# Altium schematic sheet som.SchDoc
size D; CompanyName: Signal Laboratories, Inc.; Address1: 3479 Edison Way; Address2: Menlo Park CA 94025; Address3: +1 (877) 778-8435; Address4: siglabs.com; Revision: 1; SheetNumber: 1; SheetTotal: 1
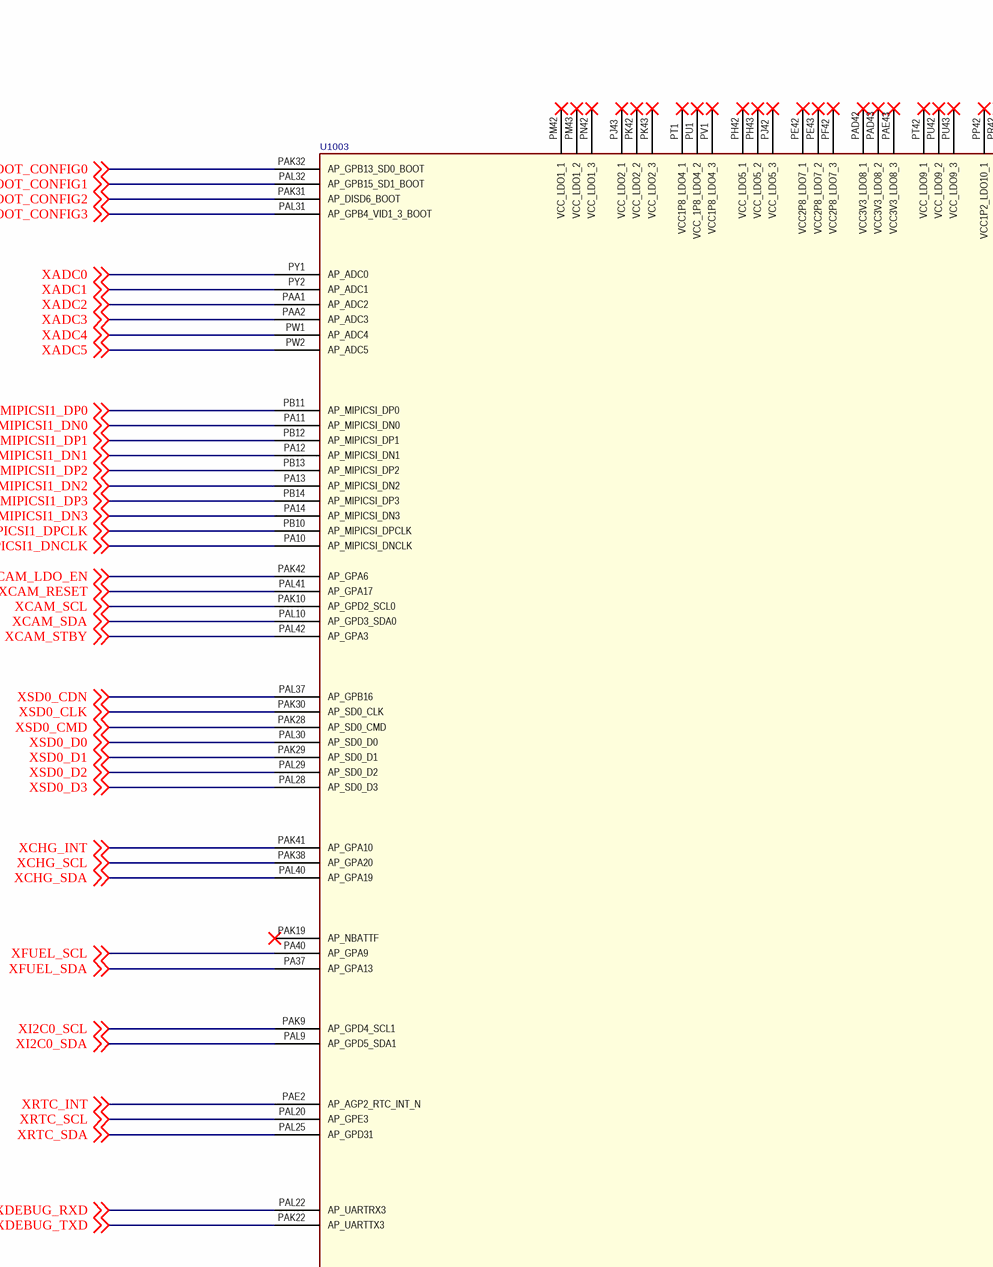
[diagram p0: som.SchDoc, top left]
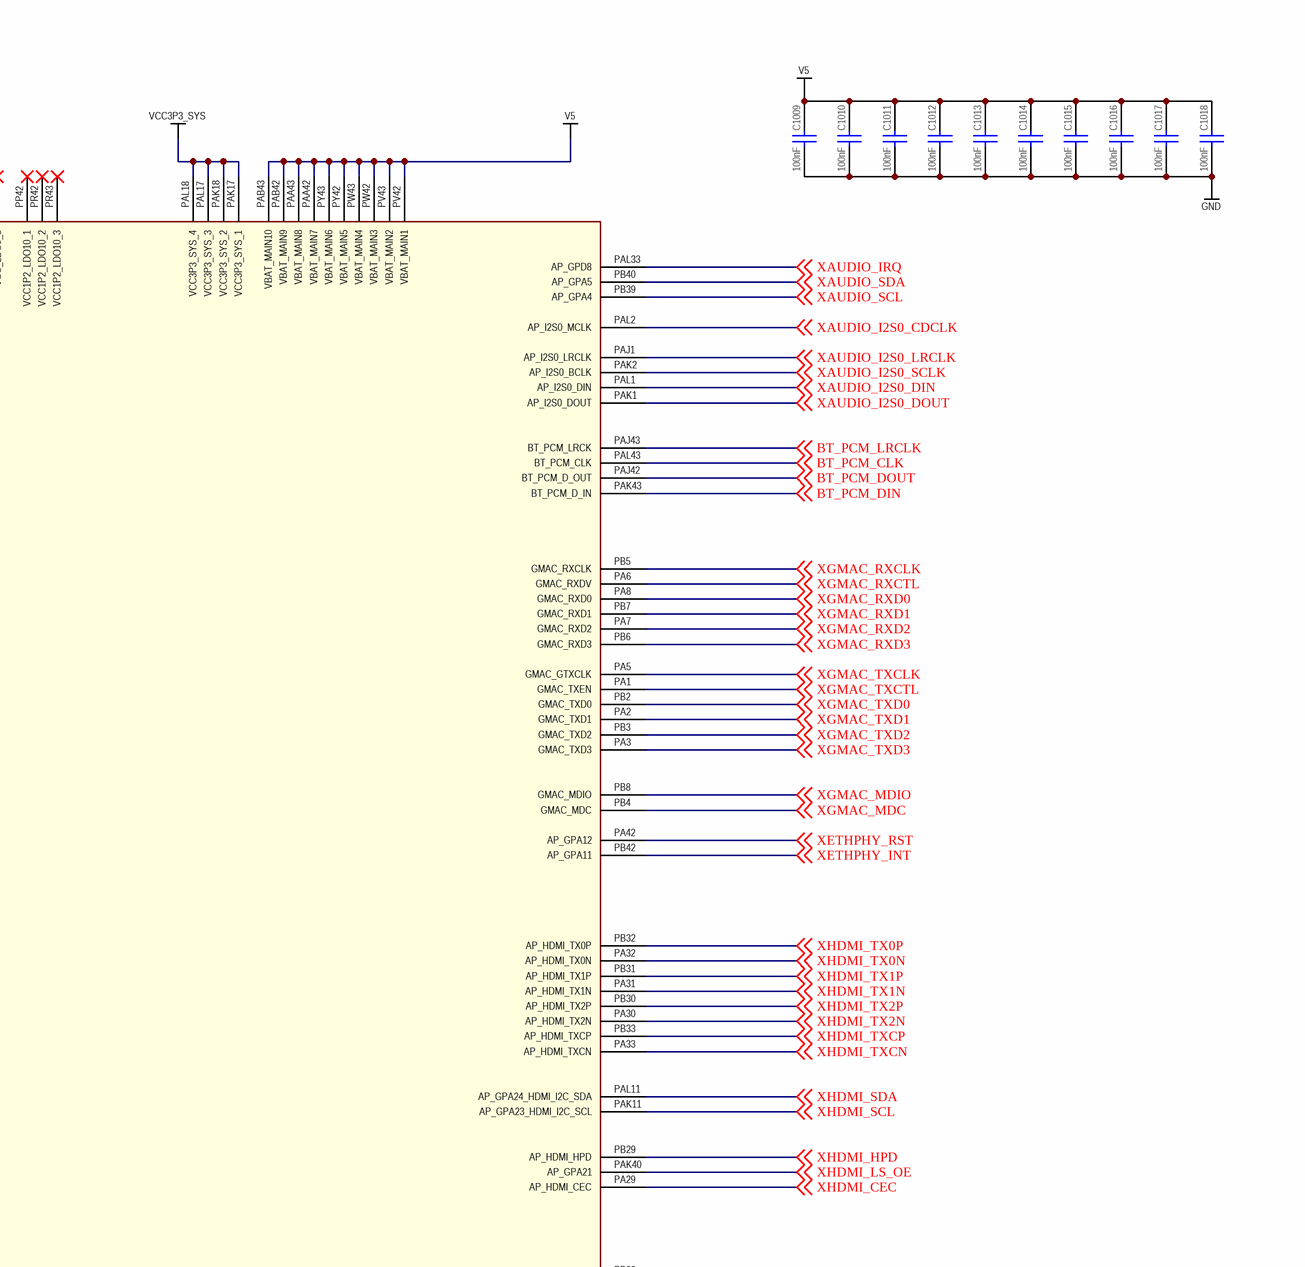
[diagram p1: som.SchDoc, top right]
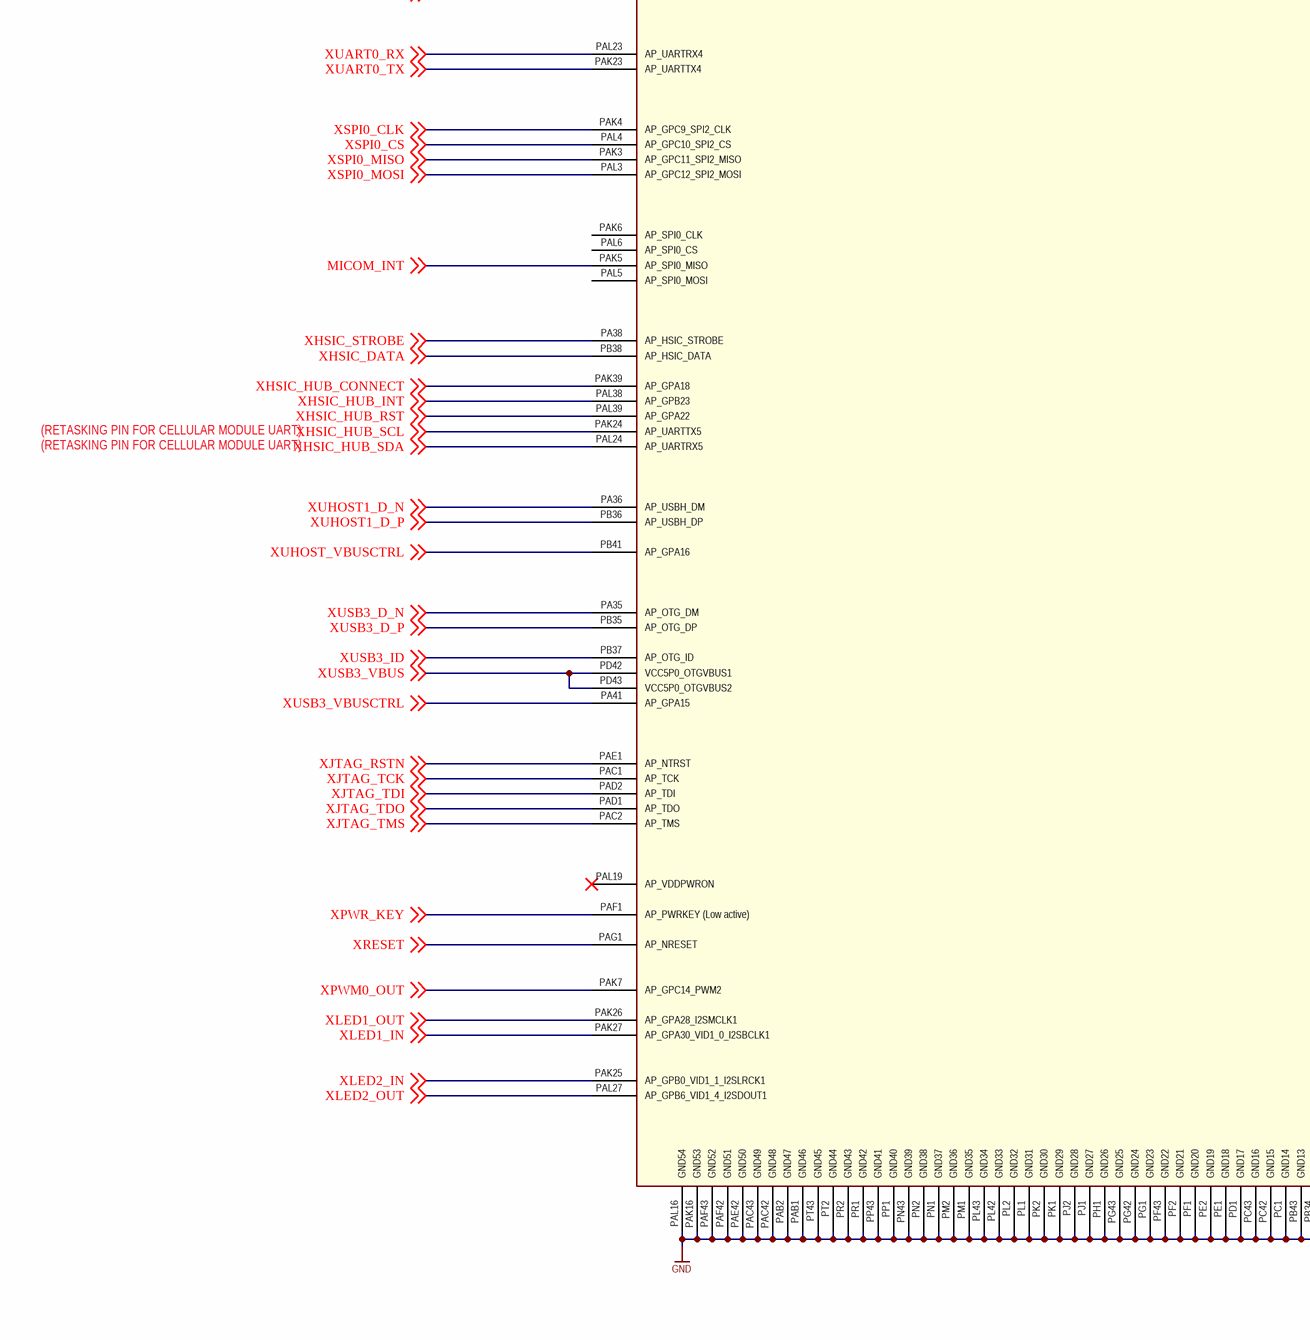
[diagram p2: som.SchDoc, bottom left]
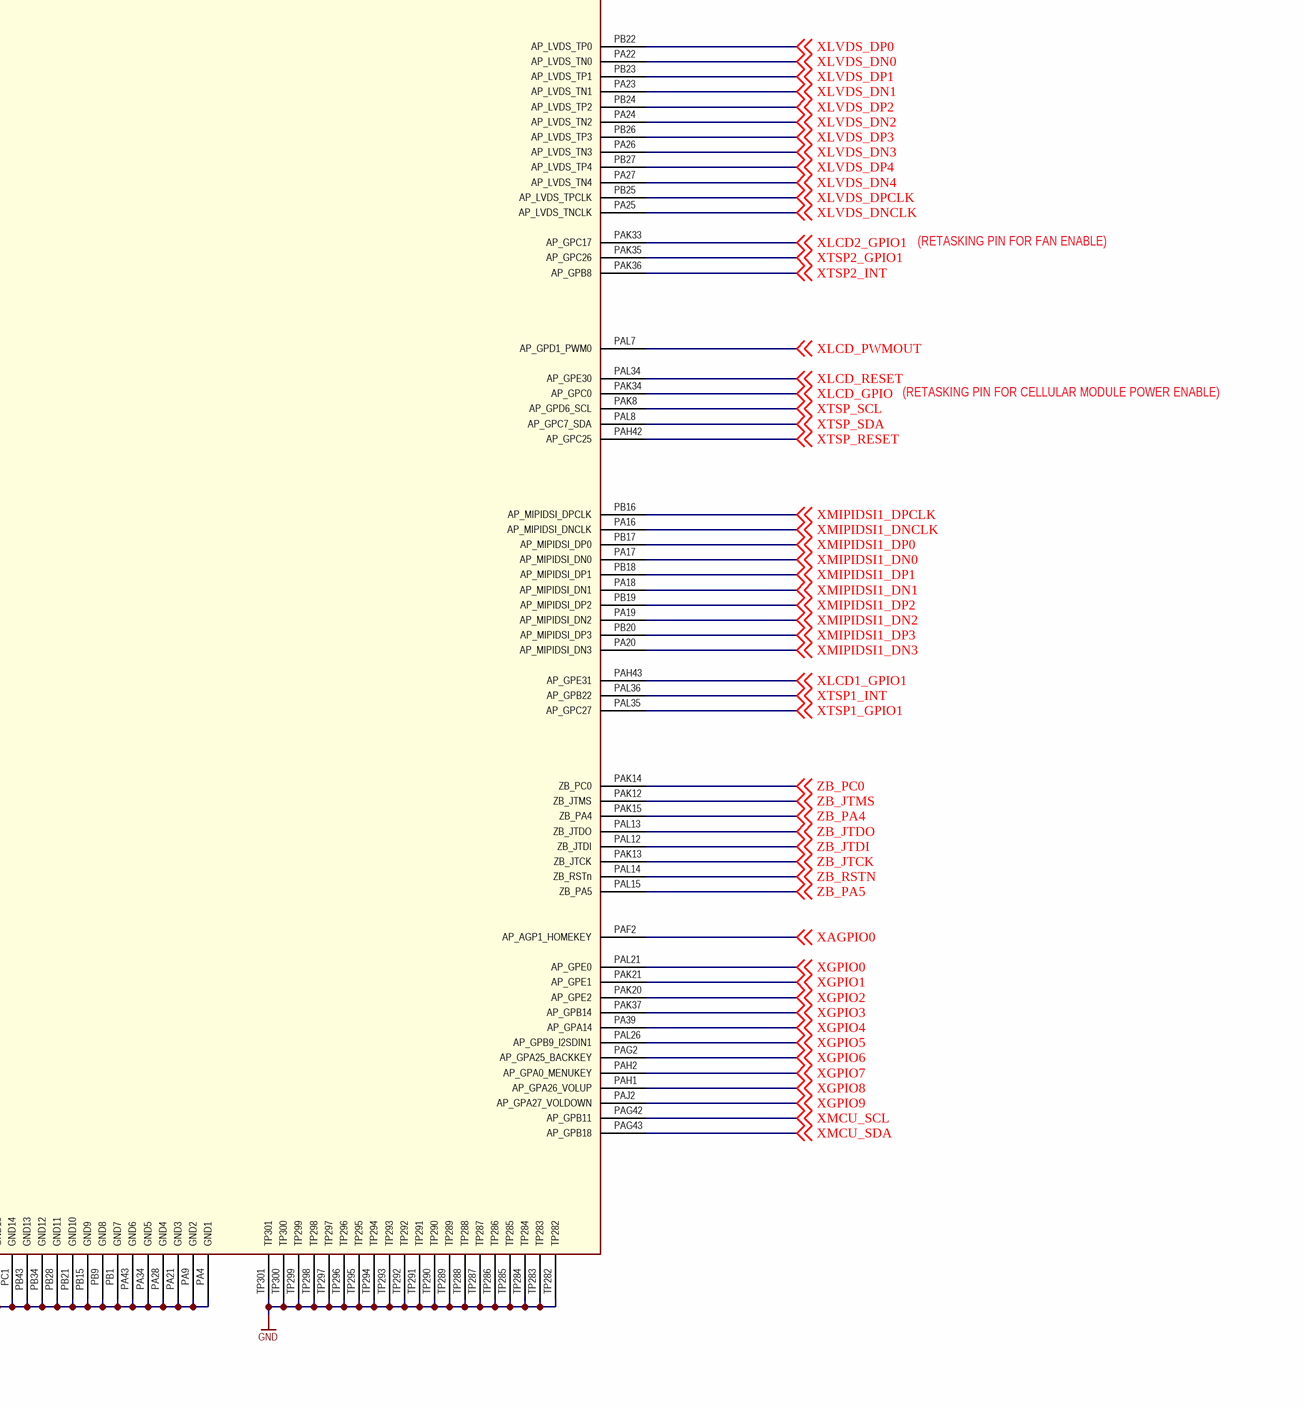
[diagram p3: som.SchDoc, bottom right]

## Parts
C1009  value 100nF  [CAPC100X50X55L25N]  (hidden comment: GCM155R71H104KE02)
C1010  value 100nF  [CAPC100X50X55L25N]  (hidden comment: GCM155R71H104KE02)
C1011  value 100nF  [CAPC100X50X55L25N]  (hidden comment: GCM155R71H104KE02)
C1012  value 100nF  [CAPC100X50X55L25N]  (hidden comment: GCM155R71H104KE02)
C1013  value 100nF  [CAPC100X50X55L25N]  (hidden comment: GCM155R71H104KE02)
C1014  value 100nF  [CAPC100X50X55L25N]  (hidden comment: GCM155R71H104KE02)
C1015  value 100nF  [CAPC100X50X55L25N]  (hidden comment: GCM155R71H104KE02)
C1016  value 100nF  [CAPC100X50X55L25N]  (hidden comment: GCM155R71H104KE02)
C1017  value 100nF  [CAPC100X50X55L25N]  (hidden comment: GCM155R71H104KE02)
C1018  value 100nF  [CAPC100X50X55L25N]  (hidden comment: GCM155R71H104KE02)
U1003  ARTIK_710_LGA_PAD  [ARTIK_LGA_PAD_10]  (value not drawn)

## Nets
GND: C1009.1 C1010.1 C1011.1 C1012.1 C1013.1 C1014.1 C1015.1 C1016.1 C1017.1 C1018.1 U1003.PA4(GND1) U1003.PA9(GND2) U1003.PA21(GND3) U1003.PA28(GND4) U1003.PA34(GND5) U1003.PA43(GND6) U1003.PAB1(GND46) U1003.PAB2(GND47) U1003.PAC42(GND48) U1003.PAC43(GND49) U1003.PAE42(GND50) U1003.PAF42(GND51) U1003.PAF43(GND52) U1003.PAK16(GND53) U1003.PAL16(GND54) U1003.PB1(GND7) U1003.PB9(GND8) U1003.PB15(GND9) U1003.PB21(GND10) U1003.PB28(GND11) U1003.PB34(GND12) U1003.PB43(GND13) U1003.PC1(GND14) U1003.PC42(GND15) U1003.PC43(GND16) U1003.PD1(GND17) U1003.PE1(GND18) U1003.PE2(GND19) U1003.PF1(GND20) U1003.PF2(GND21) U1003.PF43(GND22) U1003.PG1(GND23) U1003.PG42(GND24) U1003.PG43(GND25) U1003.PH1(GND26) U1003.PJ1(GND27) U1003.PJ2(GND28) U1003.PK1(GND29) U1003.PK2(GND30) U1003.PL1(GND31) U1003.PL2(GND32) U1003.PL42(GND33) U1003.PL43(GND34) U1003.PM1(GND35) U1003.PM2(GND36) U1003.PN1(GND37) U1003.PN2(GND38) U1003.PN43(GND39) U1003.PP1(GND40) U1003.PP43(GND41) U1003.PR1(GND42) U1003.PR2(GND43) U1003.PT2(GND44) U1003.PT43(GND45) U1003.TP282 U1003.TP283 U1003.TP284 U1003.TP285 U1003.TP286 U1003.TP287 U1003.TP288 U1003.TP289 U1003.TP290 U1003.TP291 U1003.TP292 U1003.TP293 U1003.TP294 U1003.TP295 U1003.TP296 U1003.TP297 U1003.TP298 U1003.TP299 U1003.TP300 U1003.TP301
V5: C1009.2 C1010.2 C1011.2 C1012.2 C1013.2 C1014.2 C1015.2 C1016.2 C1017.2 C1018.2 U1003.PAA42(VBAT_MAIN7) U1003.PAA43(VBAT_MAIN8) U1003.PAB42(VBAT_MAIN9) U1003.PAB43(VBAT_MAIN10) U1003.PV42(VBAT_MAIN1) U1003.PV43(VBAT_MAIN2) U1003.PW42(VBAT_MAIN3) U1003.PW43(VBAT_MAIN4) U1003.PY42(VBAT_MAIN5) U1003.PY43(VBAT_MAIN6)
VCC3P3_SYS: U1003.PAK17(VCC3P3_SYS_1) U1003.PAK18(VCC3P3_SYS_2) U1003.PAL17(VCC3P3_SYS_3) U1003.PAL18(VCC3P3_SYS_4)
BT_PCM_CLK: U1003.PAL43(BT_PCM_CLK) ; off-sheet BT_PCM_CLK
BT_PCM_DIN: U1003.PAK43(BT_PCM_D_IN) ; off-sheet BT_PCM_DIN
BT_PCM_DOUT: U1003.PAJ42(BT_PCM_D_OUT) ; off-sheet BT_PCM_DOUT
BT_PCM_LRCLK: U1003.PAJ43(BT_PCM_LRCK) ; off-sheet BT_PCM_LRCLK
MICOM_INT: U1003.PAK5(AP_SPI0_MISO) ; off-sheet MICOM_INT
XADC0: U1003.PY1(AP_ADC0) ; off-sheet XADC0
XADC1: U1003.PY2(AP_ADC1) ; off-sheet XADC1
XADC2: U1003.PAA1(AP_ADC2) ; off-sheet XADC2
XADC3: U1003.PAA2(AP_ADC3) ; off-sheet XADC3
XADC4: U1003.PW1(AP_ADC4) ; off-sheet XADC4
XADC5: U1003.PW2(AP_ADC5) ; off-sheet XADC5
XAGPIO0: U1003.PAF2(AP_AGP1_HOMEKEY) ; off-sheet XAGPIO0
XAUDIO_I2S0_CDCLK: U1003.PAL2(AP_I2S0_MCLK) ; off-sheet XAUDIO_I2S0_CDCLK
XAUDIO_I2S0_DIN: U1003.PAL1(AP_I2S0_DIN) ; off-sheet XAUDIO_I2S0_DIN
XAUDIO_I2S0_DOUT: U1003.PAK1(AP_I2S0_DOUT) ; off-sheet XAUDIO_I2S0_DOUT
XAUDIO_I2S0_LRCLK: U1003.PAJ1(AP_I2S0_LRCLK) ; off-sheet XAUDIO_I2S0_LRCLK
XAUDIO_I2S0_SCLK: U1003.PAK2(AP_I2S0_BCLK) ; off-sheet XAUDIO_I2S0_SCLK
XAUDIO_IRQ: U1003.PAL33(AP_GPD8) ; off-sheet XAUDIO_IRQ
XAUDIO_SCL: U1003.PB39(AP_GPA4) ; off-sheet XAUDIO_SCL
XAUDIO_SDA: U1003.PB40(AP_GPA5) ; off-sheet XAUDIO_SDA
XBOOT_CONFIG0: U1003.PAK32(AP_GPB13_SD0_BOOT) ; off-sheet XBOOT_CONFIG0
XBOOT_CONFIG1: U1003.PAL32(AP_GPB15_SD1_BOOT) ; off-sheet XBOOT_CONFIG1
XBOOT_CONFIG2: U1003.PAK31(AP_DISD6_BOOT) ; off-sheet XBOOT_CONFIG2
XBOOT_CONFIG3: U1003.PAL31(AP_GPB4_VID1_3_BOOT) ; off-sheet XBOOT_CONFIG3
XCAM_LDO_EN: U1003.PAK42(AP_GPA6) ; off-sheet XCAM_LDO_EN
XCAM_RESET: U1003.PAL41(AP_GPA17) ; off-sheet XCAM_RESET
XCAM_SCL: U1003.PAK10(AP_GPD2_SCL0) ; off-sheet XCAM_SCL
XCAM_SDA: U1003.PAL10(AP_GPD3_SDA0) ; off-sheet XCAM_SDA
XCAM_STBY: U1003.PAL42(AP_GPA3) ; off-sheet XCAM_STBY
XCHG_INT: U1003.PAK41(AP_GPA10) ; off-sheet XCHG_INT
XCHG_SCL: U1003.PAK38(AP_GPA20) ; off-sheet XCHG_SCL
XCHG_SDA: U1003.PAL40(AP_GPA19) ; off-sheet XCHG_SDA
XDEBUG_RXD: U1003.PAL22(AP_UARTRX3) ; off-sheet XDEBUG_RXD
XDEBUG_TXD: U1003.PAK22(AP_UARTTX3) ; off-sheet XDEBUG_TXD
XETHPHY_INT: U1003.PB42(AP_GPA11) ; off-sheet XETHPHY_INT
XETHPHY_RST: U1003.PA42(AP_GPA12) ; off-sheet XETHPHY_RST
XFUEL_SCL: U1003.PA40(AP_GPA9) ; off-sheet XFUEL_SCL
XFUEL_SDA: U1003.PA37(AP_GPA13) ; off-sheet XFUEL_SDA
XGMAC_MDC: U1003.PB4(GMAC_MDC) ; off-sheet XGMAC_MDC
XGMAC_MDIO: U1003.PB8(GMAC_MDIO) ; off-sheet XGMAC_MDIO
XGMAC_RXCLK: U1003.PB5(GMAC_RXCLK) ; off-sheet XGMAC_RXCLK
XGMAC_RXCTL: U1003.PA6(GMAC_RXDV) ; off-sheet XGMAC_RXCTL
XGMAC_RXD0: U1003.PA8(GMAC_RXD0) ; off-sheet XGMAC_RXD0
XGMAC_RXD1: U1003.PB7(GMAC_RXD1) ; off-sheet XGMAC_RXD1
XGMAC_RXD2: U1003.PA7(GMAC_RXD2) ; off-sheet XGMAC_RXD2
XGMAC_RXD3: U1003.PB6(GMAC_RXD3) ; off-sheet XGMAC_RXD3
XGMAC_TXCLK: U1003.PA5(GMAC_GTXCLK) ; off-sheet XGMAC_TXCLK
XGMAC_TXCTL: U1003.PA1(GMAC_TXEN) ; off-sheet XGMAC_TXCTL
XGMAC_TXD0: U1003.PB2(GMAC_TXD0) ; off-sheet XGMAC_TXD0
XGMAC_TXD1: U1003.PA2(GMAC_TXD1) ; off-sheet XGMAC_TXD1
XGMAC_TXD2: U1003.PB3(GMAC_TXD2) ; off-sheet XGMAC_TXD2
XGMAC_TXD3: U1003.PA3(GMAC_TXD3) ; off-sheet XGMAC_TXD3
XGPIO0: U1003.PAL21(AP_GPE0) ; off-sheet XGPIO0
XGPIO1: U1003.PAK21(AP_GPE1) ; off-sheet XGPIO1
XGPIO2: U1003.PAK20(AP_GPE2) ; off-sheet XGPIO2
XGPIO3: U1003.PAK37(AP_GPB14) ; off-sheet XGPIO3
XGPIO4: U1003.PA39(AP_GPA14) ; off-sheet XGPIO4
XGPIO5: U1003.PAL26(AP_GPB9_I2SDIN1) ; off-sheet XGPIO5
XGPIO6: U1003.PAG2(AP_GPA25_BACKKEY) ; off-sheet XGPIO6
XGPIO7: U1003.PAH2(AP_GPA0_MENUKEY) ; off-sheet XGPIO7
XGPIO8: U1003.PAH1(AP_GPA26_VOLUP) ; off-sheet XGPIO8
XGPIO9: U1003.PAJ2(AP_GPA27_VOLDOWN) ; off-sheet XGPIO9
XHDMI_CEC: U1003.PA29(AP_HDMI_CEC) ; off-sheet XHDMI_CEC
XHDMI_HPD: U1003.PB29(AP_HDMI_HPD) ; off-sheet XHDMI_HPD
XHDMI_LS_OE: U1003.PAK40(AP_GPA21) ; off-sheet XHDMI_LS_OE
XHDMI_SCL: U1003.PAK11(AP_GPA23_HDMI_I2C_SCL) ; off-sheet XHDMI_SCL
XHDMI_SDA: U1003.PAL11(AP_GPA24_HDMI_I2C_SDA) ; off-sheet XHDMI_SDA
XHDMI_TX0N: U1003.PA32(AP_HDMI_TX0N) ; off-sheet XHDMI_TX0N
XHDMI_TX0P: U1003.PB32(AP_HDMI_TX0P) ; off-sheet XHDMI_TX0P
XHDMI_TX1N: U1003.PA31(AP_HDMI_TX1N) ; off-sheet XHDMI_TX1N
XHDMI_TX1P: U1003.PB31(AP_HDMI_TX1P) ; off-sheet XHDMI_TX1P
XHDMI_TX2N: U1003.PA30(AP_HDMI_TX2N) ; off-sheet XHDMI_TX2N
XHDMI_TX2P: U1003.PB30(AP_HDMI_TX2P) ; off-sheet XHDMI_TX2P
XHDMI_TXCN: U1003.PA33(AP_HDMI_TXCN) ; off-sheet XHDMI_TXCN
XHDMI_TXCP: U1003.PB33(AP_HDMI_TXCP) ; off-sheet XHDMI_TXCP
XHSIC_DATA: U1003.PB38(AP_HSIC_DATA) ; off-sheet XHSIC_DATA
XHSIC_HUB_CONNECT: U1003.PAK39(AP_GPA18) ; off-sheet XHSIC_HUB_CONNECT
XHSIC_HUB_INT: U1003.PAL38(AP_GPB23) ; off-sheet XHSIC_HUB_INT
XHSIC_HUB_RST: U1003.PAL39(AP_GPA22) ; off-sheet XHSIC_HUB_RST
XHSIC_HUB_SCL: U1003.PAK24(AP_UARTTX5) ; off-sheet XHSIC_HUB_SCL
XHSIC_HUB_SDA: U1003.PAL24(AP_UARTRX5) ; off-sheet XHSIC_HUB_SDA
XHSIC_STROBE: U1003.PA38(AP_HSIC_STROBE) ; off-sheet XHSIC_STROBE
XI2C0_SCL: U1003.PAK9(AP_GPD4_SCL1) ; off-sheet XI2C0_SCL
XI2C0_SDA: U1003.PAL9(AP_GPD5_SDA1) ; off-sheet XI2C0_SDA
XJTAG_RSTN: U1003.PAE1(AP_NTRST) ; off-sheet XJTAG_RSTN
XJTAG_TCK: U1003.PAC1(AP_TCK) ; off-sheet XJTAG_TCK
XJTAG_TDI: U1003.PAD2(AP_TDI) ; off-sheet XJTAG_TDI
XJTAG_TDO: U1003.PAD1(AP_TDO) ; off-sheet XJTAG_TDO
XJTAG_TMS: U1003.PAC2(AP_TMS) ; off-sheet XJTAG_TMS
XLCD1_GPIO1: U1003.PAH43(AP_GPE31) ; off-sheet XLCD1_GPIO1
XLCD2_GPIO1: U1003.PAK33(AP_GPC17) ; off-sheet XLCD2_GPIO1
XLCD_GPIO: U1003.PAK34(AP_GPC0) ; off-sheet XLCD_GPIO
XLCD_PWMOUT: U1003.PAL7(AP_GPD1_PWM0) ; off-sheet XLCD_PWMOUT
XLCD_RESET: U1003.PAL34(AP_GPE30) ; off-sheet XLCD_RESET
XLED1_IN: U1003.PAK27(AP_GPA30_VID1_0_I2SBCLK1) ; off-sheet XLED1_IN
XLED1_OUT: U1003.PAK26(AP_GPA28_I2SMCLK1) ; off-sheet XLED1_OUT
XLED2_IN: U1003.PAK25(AP_GPB0_VID1_1_I2SLRCK1) ; off-sheet XLED2_IN
XLED2_OUT: U1003.PAL27(AP_GPB6_VID1_4_I2SDOUT1) ; off-sheet XLED2_OUT
XLVDS_DN0: U1003.PA22(AP_LVDS_TN0) ; off-sheet XLVDS_DN0
XLVDS_DN1: U1003.PA23(AP_LVDS_TN1) ; off-sheet XLVDS_DN1
XLVDS_DN2: U1003.PA24(AP_LVDS_TN2) ; off-sheet XLVDS_DN2
XLVDS_DN3: U1003.PA26(AP_LVDS_TN3) ; off-sheet XLVDS_DN3
XLVDS_DN4: U1003.PA27(AP_LVDS_TN4) ; off-sheet XLVDS_DN4
XLVDS_DNCLK: U1003.PA25(AP_LVDS_TNCLK) ; off-sheet XLVDS_DNCLK
XLVDS_DP0: U1003.PB22(AP_LVDS_TP0) ; off-sheet XLVDS_DP0
XLVDS_DP1: U1003.PB23(AP_LVDS_TP1) ; off-sheet XLVDS_DP1
XLVDS_DP2: U1003.PB24(AP_LVDS_TP2) ; off-sheet XLVDS_DP2
XLVDS_DP3: U1003.PB26(AP_LVDS_TP3) ; off-sheet XLVDS_DP3
XLVDS_DP4: U1003.PB27(AP_LVDS_TP4) ; off-sheet XLVDS_DP4
XLVDS_DPCLK: U1003.PB25(AP_LVDS_TPCLK) ; off-sheet XLVDS_DPCLK
XMCU_SCL: U1003.PAG42(AP_GPB11) ; off-sheet XMCU_SCL
XMCU_SDA: U1003.PAG43(AP_GPB18) ; off-sheet XMCU_SDA
XMIPICSI1_DN0: U1003.PA11(AP_MIPICSI_DN0) ; off-sheet XMIPICSI1_DN0
XMIPICSI1_DN1: U1003.PA12(AP_MIPICSI_DN1) ; off-sheet XMIPICSI1_DN1
XMIPICSI1_DN2: U1003.PA13(AP_MIPICSI_DN2) ; off-sheet XMIPICSI1_DN2
XMIPICSI1_DN3: U1003.PA14(AP_MIPICSI_DN3) ; off-sheet XMIPICSI1_DN3
XMIPICSI1_DNCLK: U1003.PA10(AP_MIPICSI_DNCLK) ; off-sheet XMIPICSI1_DNCLK
XMIPICSI1_DP0: U1003.PB11(AP_MIPICSI_DP0) ; off-sheet XMIPICSI1_DP0
XMIPICSI1_DP1: U1003.PB12(AP_MIPICSI_DP1) ; off-sheet XMIPICSI1_DP1
XMIPICSI1_DP2: U1003.PB13(AP_MIPICSI_DP2) ; off-sheet XMIPICSI1_DP2
XMIPICSI1_DP3: U1003.PB14(AP_MIPICSI_DP3) ; off-sheet XMIPICSI1_DP3
XMIPICSI1_DPCLK: U1003.PB10(AP_MIPICSI_DPCLK) ; off-sheet XMIPICSI1_DPCLK
XMIPIDSI1_DN0: U1003.PA17(AP_MIPIDSI_DN0) ; off-sheet XMIPIDSI1_DN0
XMIPIDSI1_DN1: U1003.PA18(AP_MIPIDSI_DN1) ; off-sheet XMIPIDSI1_DN1
XMIPIDSI1_DN2: U1003.PA19(AP_MIPIDSI_DN2) ; off-sheet XMIPIDSI1_DN2
XMIPIDSI1_DN3: U1003.PA20(AP_MIPIDSI_DN3) ; off-sheet XMIPIDSI1_DN3
XMIPIDSI1_DNCLK: U1003.PA16(AP_MIPIDSI_DNCLK) ; off-sheet XMIPIDSI1_DNCLK
XMIPIDSI1_DP0: U1003.PB17(AP_MIPIDSI_DP0) ; off-sheet XMIPIDSI1_DP0
XMIPIDSI1_DP1: U1003.PB18(AP_MIPIDSI_DP1) ; off-sheet XMIPIDSI1_DP1
XMIPIDSI1_DP2: U1003.PB19(AP_MIPIDSI_DP2) ; off-sheet XMIPIDSI1_DP2
XMIPIDSI1_DP3: U1003.PB20(AP_MIPIDSI_DP3) ; off-sheet XMIPIDSI1_DP3
XMIPIDSI1_DPCLK: U1003.PB16(AP_MIPIDSI_DPCLK) ; off-sheet XMIPIDSI1_DPCLK
XPWM0_OUT: U1003.PAK7(AP_GPC14_PWM2) ; off-sheet XPWM0_OUT
XPWR_KEY: U1003.PAF1(AP_PWRKEY_(Low_active)) ; off-sheet XPWR_KEY
XRESET: U1003.PAG1(AP_NRESET) ; off-sheet XRESET
XRTC_INT: U1003.PAE2(AP_AGP2_RTC_INT_N) ; off-sheet XRTC_INT
XRTC_SCL: U1003.PAL20(AP_GPE3) ; off-sheet XRTC_SCL
XRTC_SDA: U1003.PAL25(AP_GPD31) ; off-sheet XRTC_SDA
XSD0_CDN: U1003.PAL37(AP_GPB16) ; off-sheet XSD0_CDN
XSD0_CLK: U1003.PAK30(AP_SD0_CLK) ; off-sheet XSD0_CLK
XSD0_CMD: U1003.PAK28(AP_SD0_CMD) ; off-sheet XSD0_CMD
XSD0_D0: U1003.PAL30(AP_SD0_D0) ; off-sheet XSD0_D0
XSD0_D1: U1003.PAK29(AP_SD0_D1) ; off-sheet XSD0_D1
XSD0_D2: U1003.PAL29(AP_SD0_D2) ; off-sheet XSD0_D2
XSD0_D3: U1003.PAL28(AP_SD0_D3) ; off-sheet XSD0_D3
XSPI0_CLK: U1003.PAK4(AP_GPC9_SPI2_CLK) ; off-sheet XSPI0_CLK
XSPI0_CS: U1003.PAL4(AP_GPC10_SPI2_CS) ; off-sheet XSPI0_CS
XSPI0_MISO: U1003.PAK3(AP_GPC11_SPI2_MISO) ; off-sheet XSPI0_MISO
XSPI0_MOSI: U1003.PAL3(AP_GPC12_SPI2_MOSI) ; off-sheet XSPI0_MOSI
XTSP1_GPIO1: U1003.PAL35(AP_GPC27) ; off-sheet XTSP1_GPIO1
XTSP1_INT: U1003.PAL36(AP_GPB22) ; off-sheet XTSP1_INT
XTSP2_GPIO1: U1003.PAK35(AP_GPC26) ; off-sheet XTSP2_GPIO1
XTSP2_INT: U1003.PAK36(AP_GPB8) ; off-sheet XTSP2_INT
XTSP_RESET: U1003.PAH42(AP_GPC25) ; off-sheet XTSP_RESET
XTSP_SCL: U1003.PAK8(AP_GPD6_SCL) ; off-sheet XTSP_SCL
XTSP_SDA: U1003.PAL8(AP_GPC7_SDA) ; off-sheet XTSP_SDA
XUART0_RX: U1003.PAL23(AP_UARTRX4) ; off-sheet XUART0_RX
XUART0_TX: U1003.PAK23(AP_UARTTX4) ; off-sheet XUART0_TX
XUHOST1_D_N: U1003.PA36(AP_USBH_DM) ; off-sheet XUHOST1_D_N
XUHOST1_D_P: U1003.PB36(AP_USBH_DP) ; off-sheet XUHOST1_D_P
XUHOST_VBUSCTRL: U1003.PB41(AP_GPA16) ; off-sheet XUHOST_VBUSCTRL
XUSB3_D_N: U1003.PA35(AP_OTG_DM) ; off-sheet XUSB3_D_N
XUSB3_D_P: U1003.PB35(AP_OTG_DP) ; off-sheet XUSB3_D_P
XUSB3_ID: U1003.PB37(AP_OTG_ID) ; off-sheet XUSB3_ID
XUSB3_VBUS: U1003.PD42(VCC5P0_OTGVBUS1) U1003.PD43(VCC5P0_OTGVBUS2) ; off-sheet XUSB3_VBUS
XUSB3_VBUSCTRL: U1003.PA41(AP_GPA15) ; off-sheet XUSB3_VBUSCTRL
ZB_JTCK: U1003.PAK13(ZB_JTCK) ; off-sheet ZB_JTCK
ZB_JTDI: U1003.PAL12(ZB_JTDI) ; off-sheet ZB_JTDI
ZB_JTDO: U1003.PAL13(ZB_JTDO) ; off-sheet ZB_JTDO
ZB_JTMS: U1003.PAK12(ZB_JTMS) ; off-sheet ZB_JTMS
ZB_PA4: U1003.PAK15(ZB_PA4) ; off-sheet ZB_PA4
ZB_PA5: U1003.PAL15(ZB_PA5) ; off-sheet ZB_PA5
ZB_PC0: U1003.PAK14(ZB_PC0) ; off-sheet ZB_PC0
ZB_RSTN: U1003.PAL14(ZB_RSTn) ; off-sheet ZB_RSTN

Not connected (* = marked no-connect by the designer): U1003 PAD42(VCC3V3_LDO8_1)* PAD43(VCC3V3_LDO8_2)* PAE43(VCC3V3_LDO8_3)* PAK6(AP_SPI0_CLK) PAK19(AP_NBATTF)* PAL5(AP_SPI0_MOSI) PAL6(AP_SPI0_CS) PAL19(AP_VDDPWRON)* PE42(VCC2P8_LDO7_1)* PE43(VCC2P8_LDO7_2)* PF42(VCC2P8_LDO7_3)* PH42(VCC_LDO5_1)* PH43(VCC_LDO5_2)* PJ42(VCC_LDO5_3)* PJ43(VCC_LDO2_1)* PK42(VCC_LDO2_2)* PK43(VCC_LDO2_3)* PM42(VCC_LDO1_1)* PM43(VCC_LDO1_2)* PN42(VCC_LDO1_3)* PP42(VCC1P2_LDO10_1)* PR42(VCC1P2_LDO10_2)* PR43(VCC1P2_LDO10_3)* PT1(VCC1P8_LDO4_1)* PT42(VCC_LDO9_1)* PU1(VCC_1P8_LDO4_2)* PU42(VCC_LDO9_2)* PU43(VCC_LDO9_3)* PV1(VCC1P8_LDO4_3)*

## Notes on the sheet
- (RETASKING PIN FOR FAN ENABLE)
- (RETASKING PIN FOR CELLULAR MODULE POWER ENABLE)
- (RETASKING PIN FOR CELLULAR MODULE UART)
- Title
- Engineer
- Revision
- Drawn By
- Sheet
- of
- Checked By
- Date

## Library data of the parts
C1009-C1018 = CAP: Ceramic Capacitor 100nF ±10% 50V X7R 0402; Manufacturer: Murata; Tr: -55:125; Manufacturer P/N: GCM155R71H104KE02; Tolerance: ±10%; Voltage: 50V; Footprint: *; Package: 0402
U1003 = ARTIK_LGA_PAD_10: ARTIK 710 System on Module; Manufacturer: Samsung; Manufacturer P/N: Artik 710